# EAGLE design dlp.vco.v1.1.4.main (EAGLE 7.2.0)
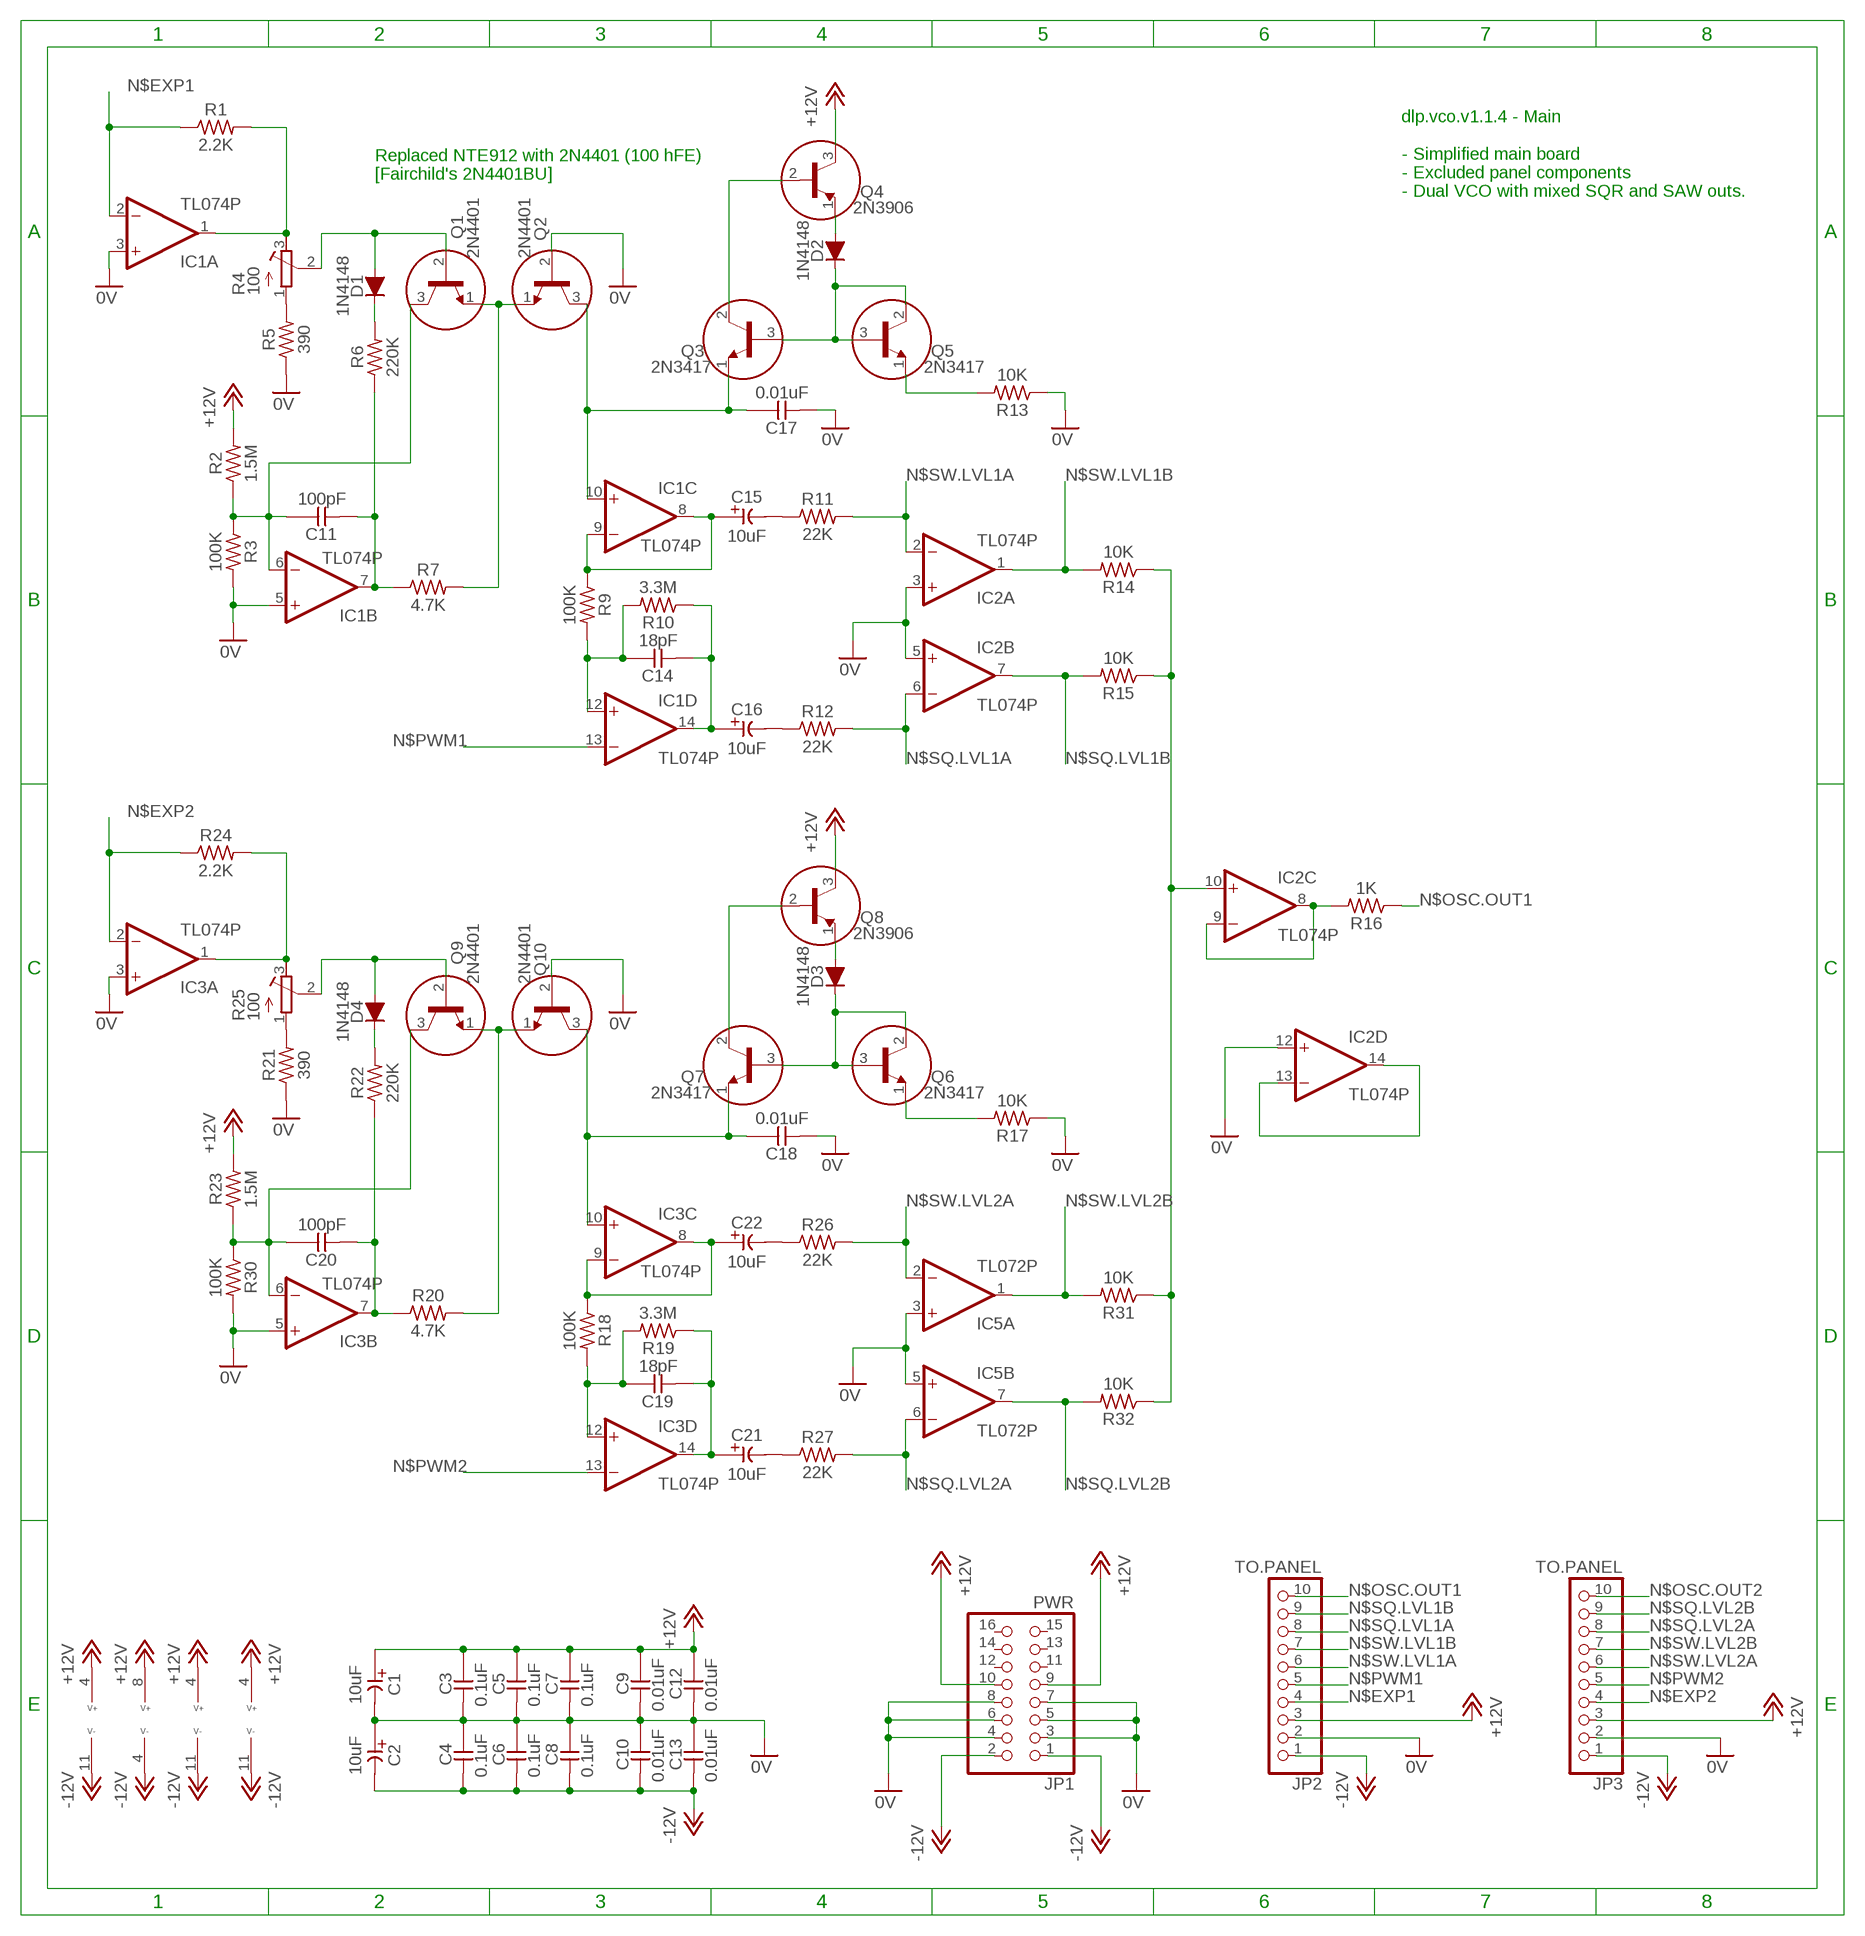
[diagram p0: schematic, sheet 1]

## Parts
C1  10uF  CE-USE2-5  [E2-5]
C2  10uF  CE-USE2-5  [E2-5]
C3  0.1uF  CC-US025-024X044  [C025-024X044]
C4  0.1uF  CC-US025-024X044  [C025-024X044]
C5  0.1uF  CC-US025-024X044  [C025-024X044]
C6  0.1uF  CC-US025-024X044  [C025-024X044]
C7  0.1uF  CC-US025-024X044  [C025-024X044]
C8  0.1uF  CC-US025-024X044  [C025-024X044]
C9  0.01uF  CC-US025-024X044  [C025-024X044]
C10  0.01uF  CC-US025-024X044  [C025-024X044]
C11  100pF  CC-US025-024X044  [C025-024X044]
C12  0.01uF  CC-US025-024X044  [C025-024X044]
C13  0.01uF  CC-US025-024X044  [C025-024X044]
C14  18pF  CC-US025-024X044  [C025-024X044]
C15  10uF  CE-USE2-5  [E2-5]
C16  10uF  CE-USE2-5  [E2-5]
C17  0.01uF  CC-US025-024X044  [C025-024X044]
C18  0.01uF  CC-US025-024X044  [C025-024X044]
C19  18pF  CC-US025-024X044  [C025-024X044]
C20  100pF  CC-US025-024X044  [C025-024X044]
C21  10uF  CE-USE2-5  [E2-5]
C22  10uF  CE-USE2-5  [E2-5]
D1  1N4148  [DO35-7]
D2  1N4148  [DO35-7]
D3  1N4148  [DO35-7]
D4  1N4148  [DO35-7]
IC1  TL074P  [DIL14]
IC2  TL074P  [DIL14]
IC3  TL074P  [DIL14]
IC5  TL072P  [DIL08]
JP1  PWR  PINHD-2X8  [2X08]
JP2  TO.PANEL  PINHD-1X10  [1X10]
JP3  TO.PANEL  PINHD-1X10  [1X10]
Q1  2N4401  [TO92]
Q2  2N4401  [TO92]
Q3  2N3417  [TO92]
Q4  2N3906  [TO92]
Q5  2N3417  [TO92]
Q6  2N3417  [TO92]
Q7  2N3417  [TO92]
Q8  2N3906  [TO92]
Q9  2N4401  [TO92]
Q10  2N4401  [TO92]
R1  2.2K  R0309/10  [0309/10]
R2  1.5M  R0309/10  [0309/10]
R3  100K  R0309/10  [0309/10]
R4  100  R-TRIMM3296Y  [RTRIM3296Y]
R5  390  R0309/10  [0309/10]
R6  220K  R0309/10  [0309/10]
R7  4.7K  R0309/10  [0309/10]
R9  100K  R0309/10  [0309/10]
R10  3.3M  R0309/10  [0309/10]
R11  22K  R0309/10  [0309/10]
R12  22K  R0309/10  [0309/10]
R13  10K  R0309/10  [0309/10]
R14  10K  R0309/10  [0309/10]
R15  10K  R0309/10  [0309/10]
R16  1K  R0309/10  [0309/10]
R17  10K  R0309/10  [0309/10]
R18  100K  R0309/10  [0309/10]
R19  3.3M  R0309/10  [0309/10]
R20  4.7K  R0309/10  [0309/10]
R21  390  R0309/10  [0309/10]
R22  220K  R0309/10  [0309/10]
R23  1.5M  R0309/10  [0309/10]
R24  2.2K  R0309/10  [0309/10]
R25  100  R-TRIMM3296Y  [RTRIM3296Y]
R26  22K  R0309/10  [0309/10]
R27  22K  R0309/10  [0309/10]
R30  100K  R0309/10  [0309/10]
R31  10K  R0309/10  [0309/10]
R32  10K  R0309/10  [0309/10]

## Nets
0V: C1.- C2.+ C3.2 C4.1 C5.2 C6.1 C7.2 C8.1 C9.2 C10.1 C12.2 C13.1 C17.2 C18.2 IC1.3(A:+IN) IC1.5(B:+IN) IC2.3(A:+IN) IC2.5(B:+IN) IC2.12(D:+IN) IC3.3(A:+IN) IC3.5(B:+IN) IC5.3(A:+IN) IC5.5(B:+IN) JP1.3 JP1.4 JP1.5 JP1.6 JP1.7 JP1.8 JP2.2 JP3.2 Q2.2(B) Q10.2(B) R3.2 R5.1 R13.1 R17.1 R21.1 R30.2
+12V: C1.+ C3.1 C5.1 C7.1 C9.1 C12.1 IC1.4(P:V+) IC2.4(P:V+) IC3.4(P:V+) IC5.8(P:V+) JP1.9 JP1.10 JP2.3 JP3.3 Q4.3(C) Q8.3(C) R2.2 R23.2
-12V: C2.- C4.2 C6.2 C8.2 C10.2 C13.2 IC1.11(P:V-) IC2.11(P:V-) IC3.11(P:V-) IC5.4(P:V-) JP1.1 JP1.2 JP2.1 JP3.1
N$1: C17.1 IC1.10(C:+IN) Q2.3(C) Q3.1(E)
N$2: Q3.2(C) Q4.2(B)
N$3: D2.A Q4.1(E)
N$4: C15.+ IC1.8(C:OUT) IC1.9(C:-IN) R9.1
N$5: D2.C Q3.3(B) Q5.2(C) Q5.3(B)
N$6: Q5.1(E) R13.2
N$7: C14.1 IC1.12(D:+IN) R9.2 R10.2
N$8: IC2.13(D:-IN) IC2.14(D:OUT)
N$9: C14.2 C16.+ IC1.14(D:OUT) R10.1
N$10: D1.A Q1.2(B) R4.2(S)
N$11: C18.1 IC3.10(C:+IN) Q7.1(E) Q10.3(C)
N$12: Q1.1(E) Q2.1(E) R7.2
N$13: D1.C R6.2
N$14: R4.1(A) R5.2
N$15: C11.1 IC1.6(B:-IN) Q1.3(C) R2.1 R3.1
N$16: IC1.1(A:OUT) R1.2 R4.3(E)
N$17: D3.A Q8.1(E)
N$18: IC2.10(C:+IN) R14.1 R15.1 R31.1 R32.1
N$19: Q6.1(E) R17.2
N$20: IC2.8(C:OUT) IC2.9(C:-IN) R16.2
N$21: D3.C Q6.2(C) Q6.3(B) Q7.3(B)
N$22: Q7.2(C) Q8.2(B)
N$23: C22.+ IC3.8(C:OUT) IC3.9(C:-IN) R18.1
N$24: C19.1 IC3.12(D:+IN) R18.2 R19.2
N$25: C19.2 C21.+ IC3.14(D:OUT) R19.1
N$26: Q9.1(E) Q10.1(E) R20.2
N$28: D4.C R22.2
N$29: C15.- R11.1
N$30: C16.- R12.1
N$31: C20.1 IC3.6(B:-IN) Q9.3(C) R23.1 R30.1
N$32: IC3.1(A:OUT) R24.2 R25.3(E)
N$33: C22.- R26.1
N$34: C21.- R27.1
N$37: C11.2 IC1.7(B:OUT) R6.1 R7.1
N$40: R21.2 R25.1(A)
N$41: C20.2 IC3.7(B:OUT) R20.1 R22.1
N$42: D4.A Q9.2(B) R25.2(S)
N$EXP1: IC1.2(A:-IN) JP2.4 R1.1
N$EXP2: IC3.2(A:-IN) JP3.4 R24.1
N$OSC.OUT1: JP2.10 R16.1
N$OSC.OUT2: JP3.10
N$PWM1: IC1.13(D:-IN) JP2.5
N$PWM2: IC3.13(D:-IN) JP3.5
N$SQ.LVL1A: IC2.6(B:-IN) JP2.8 R12.2
N$SQ.LVL1B: IC2.7(B:OUT) JP2.9 R15.2
N$SQ.LVL2A: IC5.6(B:-IN) JP3.8 R27.2
N$SQ.LVL2B: IC5.7(B:OUT) JP3.9 R32.2
N$SW.LVL1A: IC2.2(A:-IN) JP2.6 R11.2
N$SW.LVL1B: IC2.1(A:OUT) JP2.7 R14.2
N$SW.LVL2A: IC5.2(A:-IN) JP3.6 R26.2
N$SW.LVL2B: IC5.1(A:OUT) JP3.7 R31.2
Unconnected: JP1.11 JP1.12 JP1.13 JP1.14 JP1.15 JP1.16

## Notes on the sheet
- Replaced NTE912 with 2N4401 (100 hFE)
  [Fairchild's 2N4401BU]
- dlp.vco.v1.1.4 - Main
  
  - Simplified main board 
  - Excluded panel components
  - Dual VCO with mixed SQR and SAW outs.

## Library data of the parts
C1 C2 C15 C16 C21 C22 = _common:CE-US: ELECTROLYTIC CAPACITOR, US symbol
C3-C14 C17-C20 = _common:CC-US: CAPACITOR, US symbol
D1-D4 = _common:1N4148: DIODE high speed (Philips)
IC1-IC3 = _common:TL074: OP AMP
IC5 = _common:TL072: OP AMP
JP1 = pinhead:PINHD-2X8: PIN HEADER
JP2 JP3 = pinhead:PINHD-1X10: PIN HEADER
Q1 Q2 Q9 Q10 = _common:2N4401
Q3 Q5-Q7 = _common:2N3417: NPN Transistor
Q4 Q8 = _common:2N3906: PNP Transistor
R1-R3 R5-R7 R9-R24 R26 R27 R30-R32 = _common:R: RESISTOR, US symbol
R4 R25 = rcl:R-TRIMM: Trimm resistor

## Board
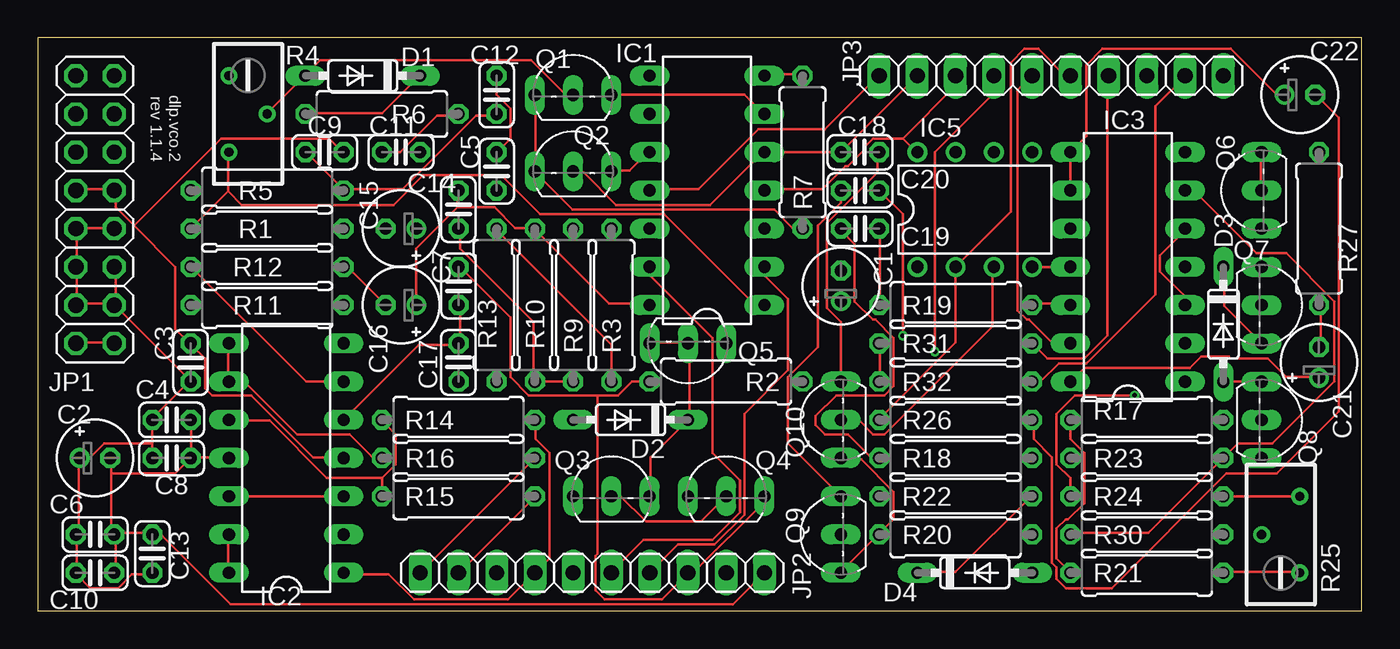
[diagram p1: board, top side]
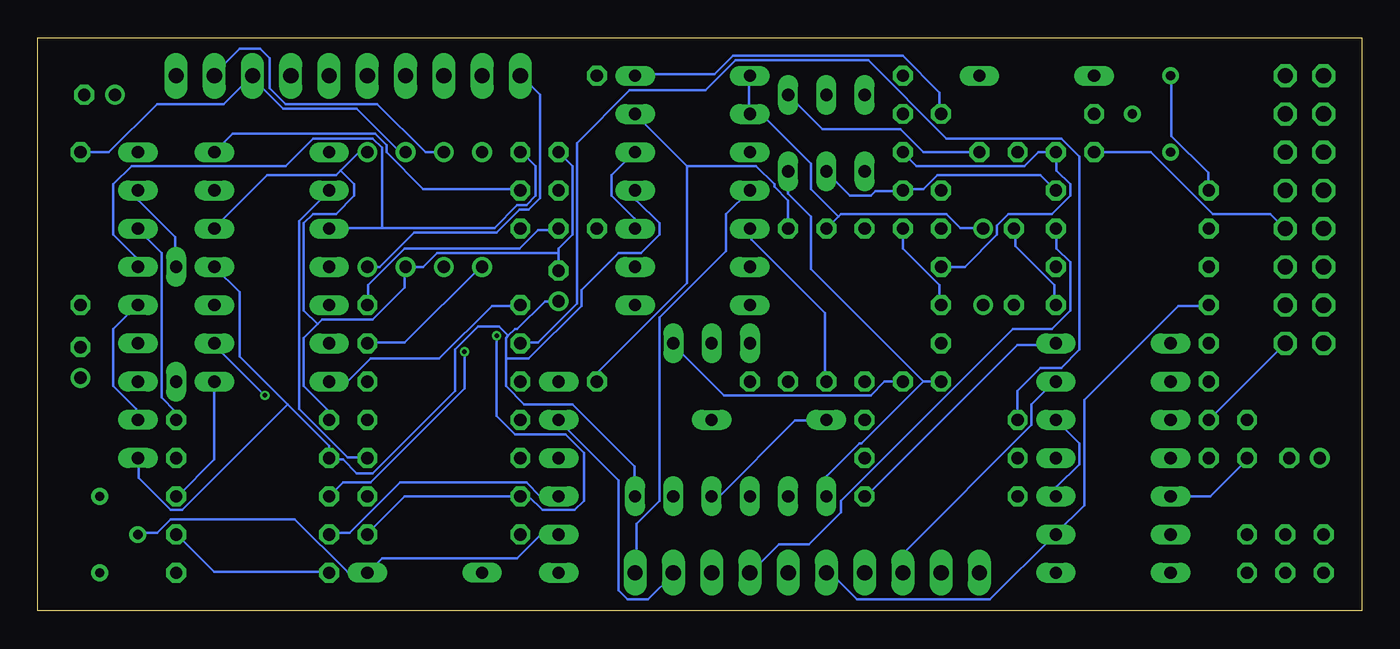
[diagram p2: board, bottom side, seen from below]

Size 87.94 x 38.09 mm. Coordinates in mm from the lower left corner, seen from the top.
Outline: 0,0 87.94,0 87.94,38.09 0,38.09 0,0
Copper layers (1*16): Top 0.035mm / dielectric 1.5mm / Bottom 0.035mm
Design rules "SeeedStudio_2layer_DRU_no_angle_20140221": minimum track width 6mil, minimum drill 12mil, track to track 6mil, track to pad 6mil, pad to pad 6mil, via to via 6mil, smd to smd 0mil, copper to edge 10mil, drill to drill 10mil, minimum pad ring 10mil, minimum via ring 6mil, stop-mask expansion 2mil, vias tented up to drill 100mil, thermal gap 10mil

### Footprints (pad centres in the part's own frame; a part is rotated, then mirrored left to right if it is on the bottom)
E2-5 = drill 0.813 pad 1.27: + -1.016,0 | drill 0.813 pad 1.27 octagon: - 1.016,0
C025-024X044 = drill 0.813 octagon: 1 -1.27,0; 2 1.27,0
DO35-7 = drill 0.813 long: A 3.81,0; C -3.81,0
DIL14 = drill 0.813 long: 1 -7.62,-3.81; 2 -5.08,-3.81; 3 -2.54,-3.81; 4 0,-3.81; 5 2.54,-3.81; 6 5.08,-3.81; 7 7.62,-3.81; 8 7.62,3.81; 9 5.08,3.81; 10 2.54,3.81; 11 0,3.81; 12 -2.54,3.81; 13 -5.08,3.81; 14 -7.62,3.81
DIL08 = drill 0.813 pad 1.27: 1 -3.81,-3.81; 2 -1.27,-3.81; 3 1.27,-3.81; 4 3.81,-3.81; 5 3.81,3.81; 6 1.27,3.81; 7 -1.27,3.81; 8 -3.81,3.81
2X08 = drill 1.016 octagon: 1 -8.89,-1.27; 2 -8.89,1.27; 3 -6.35,-1.27; 4 -6.35,1.27; 5 -3.81,-1.27; 6 -3.81,1.27; 7 -1.27,-1.27; 8 -1.27,1.27; 9 1.27,-1.27; 10 1.27,1.27; 11 3.81,-1.27; 12 3.81,1.27; 13 6.35,-1.27; 14 6.35,1.27; 15 8.89,-1.27; 16 8.89,1.27
1X10 = drill 1.016 long: 1 -11.43,0; 2 -8.89,0; 3 -6.35,0; 4 -3.81,0; 5 -1.27,0; 6 1.27,0; 7 3.81,0; 8 6.35,0; 9 8.89,0; 10 11.43,0
TO92 = drill 0.813 long: 1 -2.54,-1.27; 2 0,-1.27; 3 2.54,-1.27
0309/10 = drill 0.813 octagon: 1 -5.08,0; 2 5.08,0
RTRIM3296Y = drill 0.61: 1 1.27,-2.54; 2 -1.27,0; 3 1.27,2.54

### Placement (x,y rotation side)
C1  53.34,21.59 90 top
C2  3.81,10.16 0 top
C3  10.16,16.51 270 top
C4  8.89,12.7 0 top
C5  30.48,29.21 270 top
C6  3.81,5.08 0 top
C7  27.94,21.59 270 top
C8  8.89,10.16 0 top
C9  19.05,30.48 180 top
C10  3.81,2.54 0 top
C11  24.13,30.48 180 top
C12  30.48,34.29 270 top
C13  7.62,3.81 90 top
C14  27.94,26.67 90 top
C15  24.13,25.4 180 top
C16  24.13,20.32 180 top
C17  27.94,16.51 90 top
C18  54.61,30.48 180 top
C19  54.61,25.4 0 top
C20  54.61,27.94 0 top
C21  85.09,16.51 90 top
C22  83.82,34.29 0 top
D1  21.59,35.56 180 top
D2  39.37,12.7 180 top
D3  78.74,19.05 270 top
D4  62.23,2.54 0 top
IC1  44.45,27.94 90 top
IC2  16.51,10.16 90 top
IC3  72.39,22.86 90 top
IC5  62.23,26.67 0 top
JP1  3.81,26.67 90 top
JP2  36.83,2.54 180 top
JP3  67.31,35.56 0 top
Q1  35.56,35.56 0 top
Q2  35.56,30.48 0 top
Q3  38.1,8.89 0 top
Q4  45.72,8.89 0 top
Q5  43.18,16.51 180 top
Q6  80.01,27.94 90 top
Q7  82.55,20.32 270 top
Q8  82.55,12.7 270 top
Q9  52.07,5.08 90 top
Q10  52.07,12.7 90 top
R1  15.24,25.4 180 top
R2  45.72,15.24 180 top
R3  38.1,20.32 270 top
R4  13.97,33.02 180 top
R5  15.24,27.94 180 top
R6  22.86,33.02 180 top
R7  50.8,30.48 270 top
R9  35.56,20.32 270 top
R10  33.02,20.32 270 top
R11  15.24,20.32 180 top
R12  15.24,22.86 180 top
R13  30.48,20.32 270 top
R14  27.94,12.7 0 top
R15  27.94,7.62 0 top
R16  27.94,10.16 180 top
R17  73.66,12.7 0 top
R18  60.96,10.16 180 top
R19  60.96,20.32 0 top
R20  60.96,5.08 180 top
R21  73.66,2.54 0 top
R22  60.96,7.62 0 top
R23  73.66,10.16 180 top
R24  73.66,7.62 0 top
R25  82.55,5.08 0 top
R26  60.96,12.7 180 top
R27  85.09,25.4 90 top
R30  73.66,5.08 0 top
R31  60.96,17.78 0 top
R32  60.96,15.24 0 top

### Tracks (layer width: path | path; a pad name or v marks a point on that pad's centre or on a via)
0V
  Top 0.152: C9.2 17.83,30.48 20.27,28.04 R5.1 20.42,28.04 24.23,28.04 29.11,32.92 30.48,32.92 C12.2 | C7.2 28.04,20.27 28.04,17.83 C17.2 27.89,17.68 25.3,17.68 IC2.5 | R3.2 38.1,17.68 30.48,25.3 R13.1 | C13.1 7.62,2.44 6.25,2.44 5.33,1.52 3.5,1.52 2.59,2.44 C10.1 2.59,2.59 2.59,5.03 C6.1 2.59,5.18 2.74,5.33 2.74,10.06 C2.+ 2.9,10.21 3.5,10.21 4.42,11.12 7.62,11.12 | JP1.7 5.03,25.45 2.59,25.45 JP1.8 2.59,25.3 2.59,22.86 | 2.59,22.86 2.59,20.42 | JP1.3 5.18,20.42 5.18,22.86 JP1.5 | 2.59,20.42 5.03,20.42 JP1.3 | 2.59,20.42 JP1.4 | 2.59,22.86 JP1.6 | 7.62,11.12 C4.1 7.62,12.8 10.06,15.24 C3.2 10.21,15.24 5.18,20.27 JP1.3 | 7.62,11.12 C8.1 | IC2.12 IC2.3 | IC3.3 76.2,20.88 74.52,22.55 74.52,23.62 76.2,25.3 IC3.5 | R17.1 68.58,11.43 69.49,10.52 69.49,7.16 68.43,6.1 68.28,6.1 67.67,5.49 67.67,3.5 68.58,2.59 R21.1 | JP3.2 C18.2 IC1.5 48.16,30.48 44.65,26.98 38.41,26.98 36.27,29.11 35.66,29.11 Q2.2 | Q10.2 53.34,12.65 54.56,12.65 55.47,11.73 56.24,11.73 63.4,18.9 63.4,22.86 IC5.3
  Bottom 0.152: Q2.2 35.51,29.11 33.98,27.58 32.61,27.58 32.31,27.89 30.48,27.89 C5.2 30.48,28.04 29.11,28.04 28.19,28.96 21.34,28.96 R5.1 | R13.1 30.48,24.08 28.04,21.64 28.04,20.42 C7.2 | IC2.5 18.75,11.12 18.75,9.75 20.27,8.23 20.27,7.62 IC2.3 | IC2.12 10.06,7.62 7.62,10.06 C8.1 | C9.2 14.02,30.48 9.91,26.36 6.1,26.36 5.18,25.45 JP1.7 | IC5.5 66.6,30.48 67.82,29.26 | 67.82,29.26 68.12,28.96 72.69,28.96 76.2,25.45 IC3.5 | R21.1 68.58,2.59 76.2,2.59 78.64,5.03 R30.2 | Q10.2 53.34,12.65 49.38,8.69 49.38,1.37 48.77,0.76 47.4,0.76 45.72,2.44 JP2.2 | IC1.3 48.31,25.45 48.31,26.06 49.84,27.58 49.84,28.96 48.31,30.48 IC1.5 | 53.34,23.77 53.34,24.08 52.43,24.99 52.43,29.57 C18.2 | 53.34,23.77 C1.- | 53.34,23.77 61.42,23.77 62.33,22.86 IC5.3 63.55,22.86 63.55,21.49 65.68,19.36 69.04,19.36 69.34,19.05 | R17.1 68.58,13.26 70.26,14.94 70.26,18.14 69.34,19.05 | 67.82,29.26 66.9,28.35 66.9,27.58 68.12,26.36 69.65,26.36 70.26,25.76 70.26,19.96 69.34,19.05
+12V
  Top 0.152: JP1.10 2.59,28.04 5.03,28.04 JP1.9 5.18,27.89 5.18,26.82 6.4,25.6 | IC2.4 20.27,10.21 18.29,10.21 14.17,14.33 11.58,14.33 11.12,14.78 11.12,16.76 10.21,17.68 C3.1 10.06,17.83 9.14,18.75 9.14,22.86 6.4,25.6 | C12.1 30.48,34.29 31.39,33.38 31.39,31.39 C5.1 | R2.2 39.47,15.24 38.56,14.33 37.19,14.33 | 37.19,14.33 32.61,14.33 31.39,15.54 31.39,19.51 28.04,22.86 C7.1 | 6.4,25.6 12.19,31.39 19.36,31.39 20.27,30.48 C9.1 | 57.45,31.39 55.47,31.39 54.86,30.79 54.86,30.63 53.8,29.57 53.65,29.57 52.12,28.04 48.31,28.04 IC1.4 | 57.45,31.39 58.37,30.48 IC5.8 | JP3.3 60.96,34.9 57.45,31.39 | Q4.3 48.16,7.62 48.16,7.16 43.59,2.59 43.28,2.59 JP2.3 43.13,2.44 41.45,0.76 37.64,0.76 37.03,1.37 37.03,3.66 37.19,3.81 37.19,14.33
  Bottom 0.152: C5.1 29.57,29.57 22.4,29.57 21.49,30.48 C9.1 20.27,30.48 20.27,29.26 19.36,28.35 19.36,27.58 20.57,26.36 23.47,26.36 24.23,25.6 24.23,24.99 26.36,22.86 C7.1 | 71.32,13.72 74.52,16.92 74.52,21.18 IC3.4 | 71.32,13.72 68.58,10.97 R23.2 68.58,10.06 67.67,10.06 66.75,9.14 65.68,9.14 60.2,14.63 60.2,17.37 58.67,18.9 57.3,18.9 56.69,18.29 | 71.32,13.72 78.33,6.71 79.1,6.71 81.23,8.84 81.23,10.06 Q8.3 | C1.+ 54.25,20.57 56.08,18.75 56.24,18.75 56.69,18.29 | 56.69,18.29 56.84,18.14 56.84,16.76 | 56.84,16.76 56.84,14.94 55.63,13.72 52.43,13.72 48.31,9.6 48.31,7.62 Q4.3 | 56.84,16.76 55.32,16.76 51.82,20.27 51.82,21.34 49.38,23.77 47.85,23.77 46.63,24.99 46.63,25.76 48.16,27.28 48.16,27.89 IC1.4
-12V
  Top 0.152: C10.2 5.18,2.59 5.18,5.03 C6.2 | C6.2 5.18,5.18 7.62,5.18 C13.2 7.62,5.03 8.23,5.03 12.8,0.46 46.18,0.46 JP2.1 | 4.88,9.14 4.88,5.33 5.03,5.18 C6.2 | 4.88,9.14 4.88,10.06 C2.- | JP1.2 2.59,17.83 5.03,17.83 JP1.1 | 10.21,10.21 10.21,12.65 C4.2 | 10.21,10.21 12.65,10.21 IC2.11 | 10.21,10.21 C8.2 9.14,9.14 4.88,9.14 | IC3.11 IC5.4 | IC1.11 40.69,28.04 43.89,28.04 47.85,32 52.27,32 55.78,35.51 JP3.1
  Bottom 0.152: C4.2 JP1.1 | IC1.11 42.22,26.36 42.22,23.93 46.63,19.51 46.63,7.32 48.16,5.79 48.16,2.59 JP2.1 | IC5.4 65.23,22.86 62.94,25.15 57.45,25.15 55.93,26.67 55.32,26.67 54.56,27.43 54.56,34.29 55.78,35.51 JP3.1
N$1
  Top 0.152: Q2.3 38.1,29.26 39.32,29.26 40.54,30.48 IC1.10
  Bottom 0.152: 29.11,15.24 C17.1 | 29.11,15.24 33.22,11.12 33.38,11.12 35.51,8.99 35.51,7.62 Q3.1 | Q2.3 38.1,27.74 36.58,26.21 36.58,22.71 29.11,15.24
N$2
  Top 0.152: Q3.2 38.71,7.62 40.39,5.94 44.04,5.94 Q4.2
N$3
  Bottom 0.152: Q4.1 42.67,7.62 37.64,12.65 35.66,12.65 D2.A
N$4
  Bottom 0.152: IC1.8 40.69,35.51 40.69,33.07 IC1.9 40.54,32.92 39.78,32.92 36.58,29.72 36.58,28.04 34.75,26.21 | R9.1 34.75,26.21 | 34.75,26.21 34.59,26.36 27.58,26.36 26.67,25.45 25.15,25.45 C15.+
N$5
  Top 0.152: Q5.3 40.69,17.83 43.13,17.83 Q5.2 43.28,17.68 43.28,12.8 D2.C 40.69,10.21 40.69,7.62 Q3.3
N$6
  Bottom 0.152: R13.2 31.7,15.24 32.61,14.33 42.37,14.33 45.72,17.68 Q5.1
N$7
  Top 0.152: R9.2 R10.2 32.92,15.24 32.92,19.2 28.04,24.08 28.04,25.3 C14.1
  Bottom 0.152: IC1.12 40.54,25.3 40.54,24.69 35.66,19.81 35.66,15.24 R9.2
N$8
  Top 0.152: IC2.14 12.65,2.59 12.65,5.03 IC2.13
N$9
  Top 0.152: C16.+ 25.15,24.08 27.89,26.82 | 27.89,26.82 27.89,27.89 C14.2 | 27.89,26.82 30.33,26.82 31.7,25.45 32.92,25.45 R10.1 33.07,25.3 37.95,20.42 40.54,20.42 IC1.14
N$10
  Top 0.152: R4.2 15.24,33.07 17.68,35.51 D1.A 17.83,35.66 18.75,36.58 32.77,36.58 35.05,34.29 Q1.2
N$11
  Top 0.152: Q10.3 53.34,19.2 52.43,20.12 52.43,25.76 55.78,29.11 55.78,30.48 C18.1
  Bottom 0.152: 65.08,25.45 57.61,25.45 56.08,26.98 55.47,26.98 54.86,27.58 54.86,29.57 55.78,30.48 C18.1 | 65.08,25.45 68.58,25.45 IC3.10 | 65.08,25.45 65.08,30.79 65.68,31.39 69.65,31.39 71.48,29.57 81.69,29.57 82.91,28.35 82.91,24.99 81.38,23.47 81.38,22.86 Q7.1
N$12
  Top 0.152: Q1.1 33.07,34.29 33.07,29.26 Q2.1 33.07,29.11 35.51,26.67 48.92,26.67 50.14,25.45 50.75,25.45 R7.2
N$13
  Top 0.152: R6.2 17.83,33.07 22.86,33.07 25.3,35.51 D1.C
N$14
  Bottom 0.152: R4.1 12.65,35.51 12.65,31.55 10.21,29.11 10.21,28.04 R5.2
N$15
  Top 0.152: Q1.3 46.94,34.29 48.16,33.07 IC1.6
  Bottom 0.152: C11.1 29.11,30.48 30.63,32 35.81,32 Q1.3 | R3.1 38.1,27.28 39.01,28.19 39.01,28.35 40.23,29.57 44.81,29.57 | IC1.6 44.81,29.57 | 44.81,29.57 44.81,21.79 50.75,15.85 50.75,15.24 R2.1
N$16
  Top 0.152: 12.65,27.89 12.65,30.48 R4.3 | R1.2 12.65,27.89 | 12.65,27.89 13.56,26.98 23.62,26.98 25.6,28.96 30.79,28.96 33.38,26.36 41.6,26.36 47.55,20.42 48.16,20.42 IC1.1
N$17
  Top 0.152: Q8.1 D3.A
N$18
  Top 0.152: R32.1 55.93,15.24 55.93,17.68 R31.1 | 22.86,8.84 R15.1 | 22.86,8.84 23.77,9.75 23.77,11.73 22.86,12.65 R14.1 | 22.86,8.84 19.2,8.84 15.39,12.65 12.8,12.65 IC2.10
  Bottom 0.152: R14.1 22.86,14.63 21.34,16.15 19.96,16.15 18.75,17.37 18.75,30.18 19.96,31.39 27.58,31.39 32.77,36.58 41.6,36.58 43.59,34.59 48.62,34.59 52.12,31.09 52.12,20.42 54.71,17.83 55.78,17.83 R31.1
N$19
  Bottom 0.152: R17.2 78.79,12.8 78.79,13.26 79.7,14.17 79.7,23.77 81.23,25.3 Q6.1
N$20
  Top 0.152: IC2.8 12.65,17.68 12.65,15.24 IC2.9 13.72,15.24 17.22,11.73 20.73,11.73 22.25,10.21 22.86,10.21 R16.2
N$21
  Top 0.152: Q6.2 81.23,28.04 81.23,30.48 Q6.3 | Q7.3 78.79,20.27 78.79,22.86 D3.C
  Bottom 0.152: Q6.2 81.23,27.89 81.23,27.28 78.79,24.84 78.79,22.86 D3.C
N$22
  Bottom 0.152: Q8.2 81.38,12.8 81.38,13.41 82.91,14.94 82.91,18.75 81.38,20.27 Q7.2
N$23
  Top 0.152: IC3.9 IC3.8 69.65,31.55 69.65,36.27 70.71,37.34 79.25,37.34 82.3,34.29 C22.+
  Bottom 0.152: R18.1 66.14,10.21 67.36,10.21 70.56,13.41 70.56,25.91 68.58,27.89 IC3.9
N$24
  Top 0.152: R18.2 55.78,10.21 55.32,10.21 53.8,11.73 52.27,11.73 51.66,12.34 51.66,12.95 53.03,14.33 56.24,14.33 56.84,14.94 56.84,18.14 55.63,19.36 55.47,19.36 54.25,20.57 54.25,24.38 53.34,25.3 C19.1 | IC3.12 68.58,20.42 66.14,20.42 R19.2
  Bottom 0.152: C19.1 53.34,25.3 54.71,25.3 55.93,24.08 63.55,24.08 65.99,21.64 65.99,20.42 R19.2
N$25
  Top 0.152: C19.2 55.93,25.3 55.93,20.42 R19.1 | IC3.14 69.49,16.15 76.5,16.15 77.27,16.92 79.1,16.92 79.25,16.76 81.69,16.76 82.91,15.54 85.04,15.54 C21.+
  Bottom 0.152: IC3.14 67.36,15.24 65.84,16.76 61.27,16.76 57.76,20.27 55.93,20.27 R19.1
N$26
  Top 0.152: Q9.1 53.34,2.59 55.78,5.03 R20.2 55.93,5.18 56.84,6.1 56.84,7.92 54.71,10.06 53.34,10.06 Q10.1
N$28
  Top 0.152: D4.C 58.52,2.59 60.96,2.59 65.99,7.62 R22.2
N$29
  Bottom 0.152: R11.1 20.42,20.42 20.42,21.64 23.01,24.23 23.01,25.3 C15.-
N$30
  Top 0.152: C16.- 20.57,22.86 R12.1
N$31
  Top 0.152: R30.1 68.58,5.18 73.76,5.18 R23.1 79.7,11.12 81.99,11.12 86.11,15.24 86.11,20.57 82.91,23.77 80.92,23.77 76.81,27.89 76.2,27.89 IC3.6 | C20.1 53.34,27.13 51.82,25.6 51.82,17.53 49.84,15.54 49.84,11.12 Q9.3
  Bottom 0.152: Q9.3 54.56,7.62 55.47,8.53 63.86,8.53 67.21,5.18 68.58,5.18 R30.1
N$32
  Top 0.152: R24.2 R25.3
  Bottom 0.152: IC3.1 76.2,10.06 78.64,7.62 R24.2
N$33
  Top 0.152: R26.1 66.14,12.65 66.14,11.43 67.36,10.21 67.36,3.2 67.67,2.9 67.67,2.13 68.28,1.52 71.32,1.52 78.94,9.14 82.3,9.14 86.41,13.26 86.41,32.77 84.89,34.29 C22.-
N$34
  Top 0.152: C21.- 85.19,17.53 85.19,20.27 R27.1
N$37
  Top 0.152: IC1.7 48.31,35.66 50.75,35.66 R7.1 | C11.2 24.08,30.48 26.52,32.92 27.89,32.92 R6.1
  Bottom 0.152: IC1.7 48.16,35.66 42.98,35.66 41.76,36.88 30.48,36.88 28.04,34.44 28.04,33.07 R6.1
N$40
  Top 0.152: R25.1 83.82,2.59 78.79,2.59 R21.2
N$41  (via drill 0.3)
  Top 0.152: v57.45,18.29 57.45,26.36 C20.2
  Bottom 0.152: R20.1 65.99,5.18 63.55,7.62 R22.1 55.32,7.62 54.41,6.71 52.27,6.71 51.66,7.32 51.66,10.52 52.88,11.73 56.24,11.73 57.45,12.95 v57.45,18.29 | IC3.7 74.98,31.7 65.53,31.7 64.77,30.94 64.77,30.48 62.33,28.04 55.93,28.04 C20.2
N$42
  Bottom 0.152: R25.2 81.23,5.18 80.01,5.18 79.1,6.1 70.87,6.1 67.36,2.59 66.14,2.59 D4.A 65.08,3.5 56.08,3.5 54.56,5.03 53.34,5.03 Q9.2
N$EXP1
  Top 0.152: JP2.4 42.52,4.42 44.96,4.42 46.94,6.4 46.94,13.11 49.84,16 49.84,20.73 48.31,22.25 48.31,22.86 IC1.2
  Bottom 0.152: R1.1 20.27,25.3 20.27,24.08 19.36,23.16 19.36,19.96 20.57,18.75 23.16,18.75 34.59,7.32 34.59,6.55 36.73,4.42 38.71,4.42 40.54,2.59 JP2.4
N$EXP2  (via drill 0.3)
  Top 0.152: R24.1 68.58,8.84 67.67,9.75 67.67,13.11 68.89,14.33 v72.85,14.33 | v59.59,17.22 59.59,30.48 63.4,34.29 63.4,35.51 JP3.4
  Bottom 0.152: v72.85,14.33 76.2,17.68 IC3.2 | v59.59,17.22 59.59,14.78 65.84,8.53 67.67,8.53 R24.1
N$OSC.OUT1
  Top 0.152: JP2.10 R16.1
N$PWM1
  Top 0.152: IC1.13 40.69,22.86 40.69,22.25 44.81,18.14 44.81,10.52 46.63,8.69 46.63,6.55 44.81,4.72 40.23,4.72 38.1,2.59 JP2.5
N$PWM2
  Top 0.152: JP3.5 65.08,34.59 65.08,19.96 65.68,19.36 65.84,19.36 67.36,17.83 68.58,17.83 IC3.13
N$SQ.LVL1A
  Top 0.152: IC2.6 17.83,15.24 10.21,22.86 R12.2
  Bottom 0.152: JP2.8 30.48,3.81 21.95,12.34 21.95,13.72 20.42,15.24 IC2.6
N$SQ.LVL1B
  Top 0.152: JP2.9 28.04,2.59 33.07,7.62 R15.2
  Bottom 0.152: IC2.7 20.42,17.68 22.86,17.68 32.92,7.62 R15.2
N$SQ.LVL2A
  Bottom 0.152: IC5.6 63.86,30.48 66.75,33.38 71.63,33.38 73.76,35.51 | R27.2 83.21,30.48 80.01,33.68 75.59,33.68 73.76,35.51 | 73.76,35.51 JP3.8
N$SQ.LVL2B
  Top 0.152: R32.2 66.6,15.24 67.82,16.46 69.65,16.46 74.22,21.03 74.22,33.53 76.2,35.51 JP3.9
  Bottom 0.152: IC5.7 62.18,30.48 65.38,33.68 71.48,33.68 72.54,34.75 72.54,36.73 73.15,37.34 74.52,37.34 76.2,35.66 JP3.9
N$SW.LVL1A
  Bottom 0.152: R11.2 10.21,20.27 12.19,20.27 18.44,14.02 18.44,7.01 20.27,5.18 IC2.2 20.42,5.03 24.69,0.76 33.53,0.76 35.2,2.44 35.51,2.44 JP2.6
N$SW.LVL1B
  Top 0.152: IC2.1 20.42,2.44 23.32,2.44 24.99,0.76 31.24,0.76 JP2.7 33.98,3.5 33.98,10.52 33.07,11.43 33.07,12.65 R14.2
N$SW.LVL2A
  Top 0.152: R26.2 55.93,12.8 60.96,17.83 IC5.2 64.62,26.52 64.62,36.42 65.53,37.34 66.45,37.34 68.12,35.66 68.58,35.66 JP3.6
N$SW.LVL2B
  Top 0.152: R31.2 67.06,16.76 69.49,16.76 71.02,18.29 71.02,35.51 JP3.7
  Bottom 0.152: R31.2 65.99,17.83 63.55,17.83 58.52,22.86 IC5.1

### Text on the board
tNames: dlp.vco.2 / rev 1.1.4